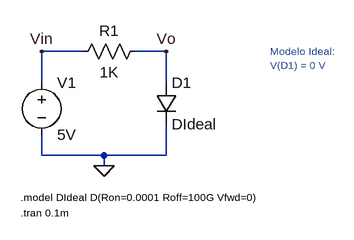
[diagram p0: schematic ejemplo_ideal.asc]
ejemplo_ideal.asc, the LTspice schematic file:
Version 4
SHEET 1 1376 680
WIRE 80 48 16 48
WIRE 208 48 160 48
WIRE 16 96 16 48
WIRE 208 96 208 48
WIRE 16 208 16 176
WIRE 112 208 16 208
WIRE 208 208 208 160
WIRE 208 208 112 208
WIRE 112 224 112 208
FLAG 112 224 0
FLAG 208 48 Vo
FLAG 16 48 Vin
SYMBOL diode 192 96 R0
SYMATTR InstName D1
SYMATTR Value DIdeal
SYMBOL voltage 16 80 R0
WINDOW 123 0 0 Left 0
WINDOW 39 0 0 Left 0
SYMATTR InstName V1
SYMATTR Value 5V
SYMBOL res 176 32 R90
WINDOW 0 0 56 VBottom 2
WINDOW 3 32 56 VTop 2
SYMATTR InstName R1
SYMATTR Value 1K
TEXT -16 296 Left 1 !.tran 0.1m
TEXT -16 272 Left 1 !.model DIdeal D(Ron=0.0001 Roff=100G Vfwd=0)
TEXT 368 48 Left 1 ;Modelo Ideal:\nV(D1) = 0 V

The netlist it stands for:
* ejemplo_ideal.asc
D1 Vo 0 DIdeal
V1 Vin 0 5V
R1 Vo Vin 1K
.model D D
.lib standard.dio
.tran 0.1m
.model DIdeal D(Ron=0.0001 Roff=100G Vfwd=0)
* Modelo Ideal:
* V(D1) = 0 V
.backanno
.end